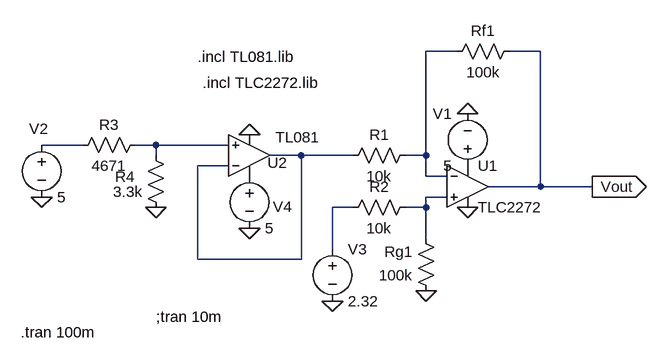
[diagram p0: schematic Working Amplifier.asc]
Working Amplifier.asc, the LTspice schematic file:
Version 4
SHEET 1 1380 680
WIRE 288 -48 240 -48
WIRE 416 -48 368 -48
WIRE -288 96 -352 96
WIRE -176 96 -208 96
WIRE -64 96 -176 96
WIRE -176 112 -176 96
WIRE 48 112 0 112
WIRE 128 112 48 112
WIRE 240 112 240 -48
WIRE 240 112 208 112
WIRE -64 128 -112 128
WIRE 240 144 240 112
WIRE 272 144 240 144
WIRE 416 160 416 -48
WIRE 416 160 336 160
WIRE 496 160 416 160
WIRE 272 176 240 176
WIRE 128 192 96 192
WIRE 240 192 240 176
WIRE 240 192 208 192
WIRE 240 240 240 192
WIRE 96 256 96 192
WIRE -112 272 -112 128
WIRE 48 272 48 112
WIRE 48 272 -112 272
FLAG 496 160 Vout
IOPIN 496 160 Out
FLAG 304 192 0
FLAG 240 320 0
FLAG 304 48 0
FLAG -352 176 0
FLAG -176 192 0
FLAG 96 336 0
FLAG -32 80 0
FLAG -32 224 0
SYMBOL OpAmps\\opamp2 304 96 R0
SYMATTR InstName U1
SYMATTR Value TLC2272
SYMBOL res 224 96 R90
WINDOW 0 0 56 VBottom 2
WINDOW 3 32 56 VTop 2
SYMATTR InstName R1
SYMATTR Value 10k
SYMBOL res 224 176 R90
WINDOW 0 0 56 VBottom 2
WINDOW 3 32 56 VTop 2
SYMATTR InstName R2
SYMATTR Value 10k
SYMBOL res 256 336 R180
WINDOW 0 36 76 Left 2
WINDOW 3 36 40 Left 2
SYMATTR InstName Rg1
SYMATTR Value 100k
SYMBOL res 272 -32 R270
WINDOW 0 32 56 VTop 2
WINDOW 3 0 56 VBottom 2
SYMATTR InstName Rf1
SYMATTR Value 100k
SYMBOL voltage 304 144 R180
WINDOW 0 24 96 Left 2
WINDOW 3 24 16 Left 2
WINDOW 123 0 0 Left 0
WINDOW 39 0 0 Left 0
SYMATTR InstName V1
SYMATTR Value 5
SYMBOL voltage -352 80 R0
WINDOW 123 0 0 Left 0
WINDOW 39 0 0 Left 0
WINDOW 0 -19 -9 Left 2
SYMATTR InstName V2
SYMATTR Value 5
SYMBOL res -192 80 R90
WINDOW 0 0 56 VBottom 2
WINDOW 3 32 56 VTop 2
SYMATTR InstName R3
SYMATTR Value 4671
SYMBOL res -160 208 R180
WINDOW 0 48 63 Left 2
WINDOW 3 36 40 Left 2
SYMATTR InstName R4
SYMATTR Value 3.3k
SYMBOL voltage 96 240 R0
WINDOW 123 0 0 Left 0
WINDOW 39 0 0 Left 0
SYMATTR InstName V3
SYMATTR Value 2.32
SYMBOL OpAmps\\opamp2 -32 176 M180
WINDOW 0 28 53 Left 2
WINDOW 3 40 92 Left 2
SYMATTR InstName U2
SYMATTR Value TL081
SYMBOL voltage -32 128 R0
WINDOW 0 36 63 Left 2
WINDOW 123 0 0 Left 0
WINDOW 39 0 0 Left 0
SYMATTR InstName V4
SYMATTR Value 5
TEXT -112 -40 Left 2 !.incl TL081.lib
TEXT -104 0 Left 2 !.incl TLC2272.lib
TEXT -176 360 Left 2 !;tran 10m
TEXT -384 384 Left 2 !.tran 100m

The netlist it stands for:
* Working Amplifier.asc
XU1 N005 N001 P001 0 Vout TLC2272  ; pins In+ In- V+ V- OUT
R1 N001 N004 10k
R2 N005 N006 10k
Rg1 0 N005 100k
Rf1 N001 Vout 100k
V1 P001 0 5
V2 N002 0 5
R3 N003 N002 4671
R4 0 N003 3.3k
V3 N006 0 2.32
XU2 N003 N004 P002 0 N004 TL081  ; pins In+ In- V+ V- OUT
V4 P002 0 5
.incl TL081.lib
.incl TLC2272.lib
;tran 10m
.tran 100m
.backanno
.end